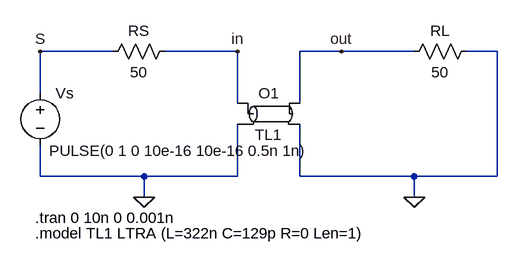
[diagram p0: schematic Exercise2_lossfreeTL.asc]
Exercise2_lossfreeTL.asc, the LTspice schematic file:
Version 4
SHEET 1 880 680
WIRE -64 32 -176 32
WIRE 128 32 16 32
WIRE 288 32 224 32
WIRE 400 32 288 32
WIRE 528 32 480 32
WIRE -176 96 -176 32
WIRE 128 112 128 32
WIRE 224 112 224 32
WIRE -176 224 -176 176
WIRE -16 224 -176 224
WIRE 128 224 128 144
WIRE 128 224 -16 224
WIRE 224 224 224 144
WIRE 400 224 224 224
WIRE 528 224 528 32
WIRE 528 224 400 224
WIRE -16 256 -16 224
WIRE 400 256 400 224
FLAG -16 256 0
FLAG 400 256 0
FLAG -176 32 S
FLAG 128 32 in
FLAG 288 32 out
SYMBOL ltline 176 128 R0
SYMATTR InstName O1
SYMATTR Value TL1
SYMBOL voltage -176 80 R0
WINDOW 3 14 105 Left 2
WINDOW 123 0 0 Left 0
WINDOW 39 0 0 Left 0
SYMATTR Value PULSE(0 1 0 10e-16 10e-16 0.5n 1n)
SYMATTR InstName Vs
SYMBOL res 32 16 R90
WINDOW 0 0 56 VBottom 2
WINDOW 3 32 56 VTop 2
SYMATTR InstName RS
SYMATTR Value 50
SYMBOL res 496 16 R90
WINDOW 0 0 56 VBottom 2
WINDOW 3 32 56 VTop 2
SYMATTR InstName RL
SYMATTR Value 50
TEXT -184 312 Left 2 !.model TL1 LTRA (L=322n C=129p R=0 Len=1)
TEXT -184 288 Left 2 !.tran 0 10n 0 0.001n

The netlist it stands for:
* Exercise2_lossfreeTL.asc
O1 in 0 out 0 TL1
Vs S 0 PULSE(0 1 0 10e-16 10e-16 0.5n 1n)
RS in S 50
RL 0 out 50
.model TL1 LTRA (L=322n C=129p R=0 Len=1)
.tran 0 10n 0 0.001n
.backanno
.end

* Results of the author's LTspice run, read from the files saved beside the schematic
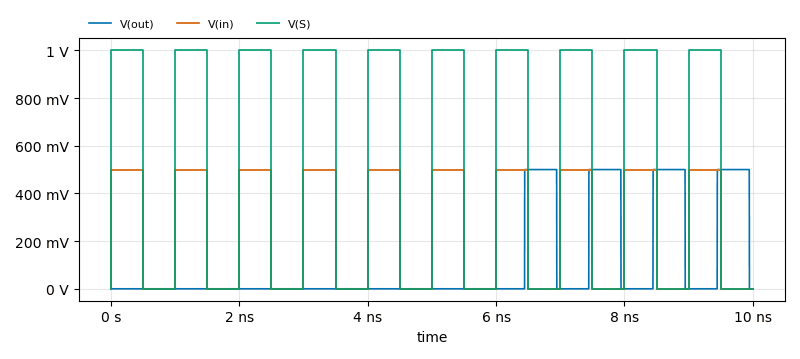
[diagram p1: Transient Analysis of Exercise2_lossfreeTL.asc, plotted from the saved traces]
* Transient Analysis, 1 run:
*   V(out): min 0 V, max 500 mV, average 100 mV, rms 223.4 mV, last 0 V
*   V(in): min 0 V, max 499.8 mV, average 249.9 mV, rms 353.4 mV, last 0 V
*   V(S): min 0 V, max 1 V, average 500 mV, rms 707.1 mV, last 0 V